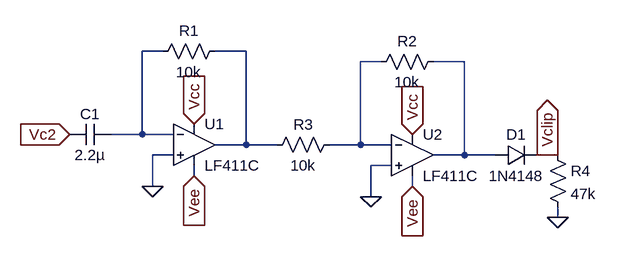
[diagram p0: schematic differentiator_clipper.asc]
differentiator_clipper.asc, the LTspice schematic file:
Version 4
SHEET 1 880 680
WIRE -80 16 -112 16
WIRE 48 16 0 16
WIRE 256 32 224 32
WIRE 384 32 336 32
WIRE -112 144 -112 16
WIRE -112 144 -160 144
WIRE -64 144 -112 144
WIRE 48 160 48 16
WIRE 48 160 0 160
WIRE 96 160 48 160
WIRE 224 160 224 32
WIRE 224 160 176 160
WIRE 272 160 224 160
WIRE -64 176 -96 176
WIRE 384 176 384 32
WIRE 384 176 336 176
WIRE 432 176 384 176
WIRE 512 176 496 176
WIRE 528 176 512 176
WIRE 272 192 240 192
WIRE -32 208 -32 192
WIRE -96 224 -96 176
WIRE 304 224 304 208
WIRE 240 240 240 192
WIRE 528 272 528 256
FLAG -96 224 0
FLAG -224 144 Vc2
IOPIN -224 144 In
FLAG -32 128 Vcc
IOPIN -32 128 In
FLAG -32 208 Vee
IOPIN -32 208 In
FLAG 240 240 0
FLAG 304 144 Vcc
IOPIN 304 144 In
FLAG 304 224 Vee
IOPIN 304 224 In
FLAG 528 272 0
FLAG 512 176 Vclip
IOPIN 512 176 Out
SYMBOL OpAmps\\opamp2 -32 96 R0
SYMATTR InstName U1
SYMATTR Value LF411C
SYMBOL res 16 0 R90
WINDOW 0 0 56 VBottom 2
WINDOW 3 32 56 VTop 2
SYMATTR InstName R1
SYMATTR Value 10k
SYMBOL cap -160 128 R90
WINDOW 0 0 32 VBottom 2
WINDOW 3 32 32 VTop 2
SYMATTR InstName C1
SYMATTR Value 2.2µ
SYMBOL OpAmps\\opamp2 304 112 R0
SYMATTR InstName U2
SYMATTR Value LF411C
SYMBOL res 352 16 R90
WINDOW 0 0 56 VBottom 2
WINDOW 3 32 56 VTop 2
SYMATTR InstName R2
SYMATTR Value 10k
SYMBOL res 192 144 R90
WINDOW 0 0 56 VBottom 2
WINDOW 3 32 56 VTop 2
SYMATTR InstName R3
SYMATTR Value 10k
SYMBOL diode 432 192 R270
WINDOW 0 32 32 VTop 2
WINDOW 3 0 32 VBottom 2
SYMATTR InstName D1
SYMATTR Value 1N4148
SYMBOL res 512 160 R0
SYMATTR InstName R4
SYMATTR Value 47k

The netlist it stands for:
* differentiator_clipper.asc
XU1 0 N001 Vcc Vee N002 LF411C  ; pins In+ In- V+ V- OUT
R1 N002 N001 10k
C1 N001 Vc2 2.2µ
XU2 0 N003 Vcc Vee N004 LF411C  ; pins In+ In- V+ V- OUT
R2 N004 N003 10k
R3 N003 N002 10k
D1 N004 Vclip 1N4148
R4 Vclip 0 47k
.model D D
.lib standard.dio
.backanno
.end